# EAGLE design mic2 (EAGLE 6.1)

## Sheet 1 of 2
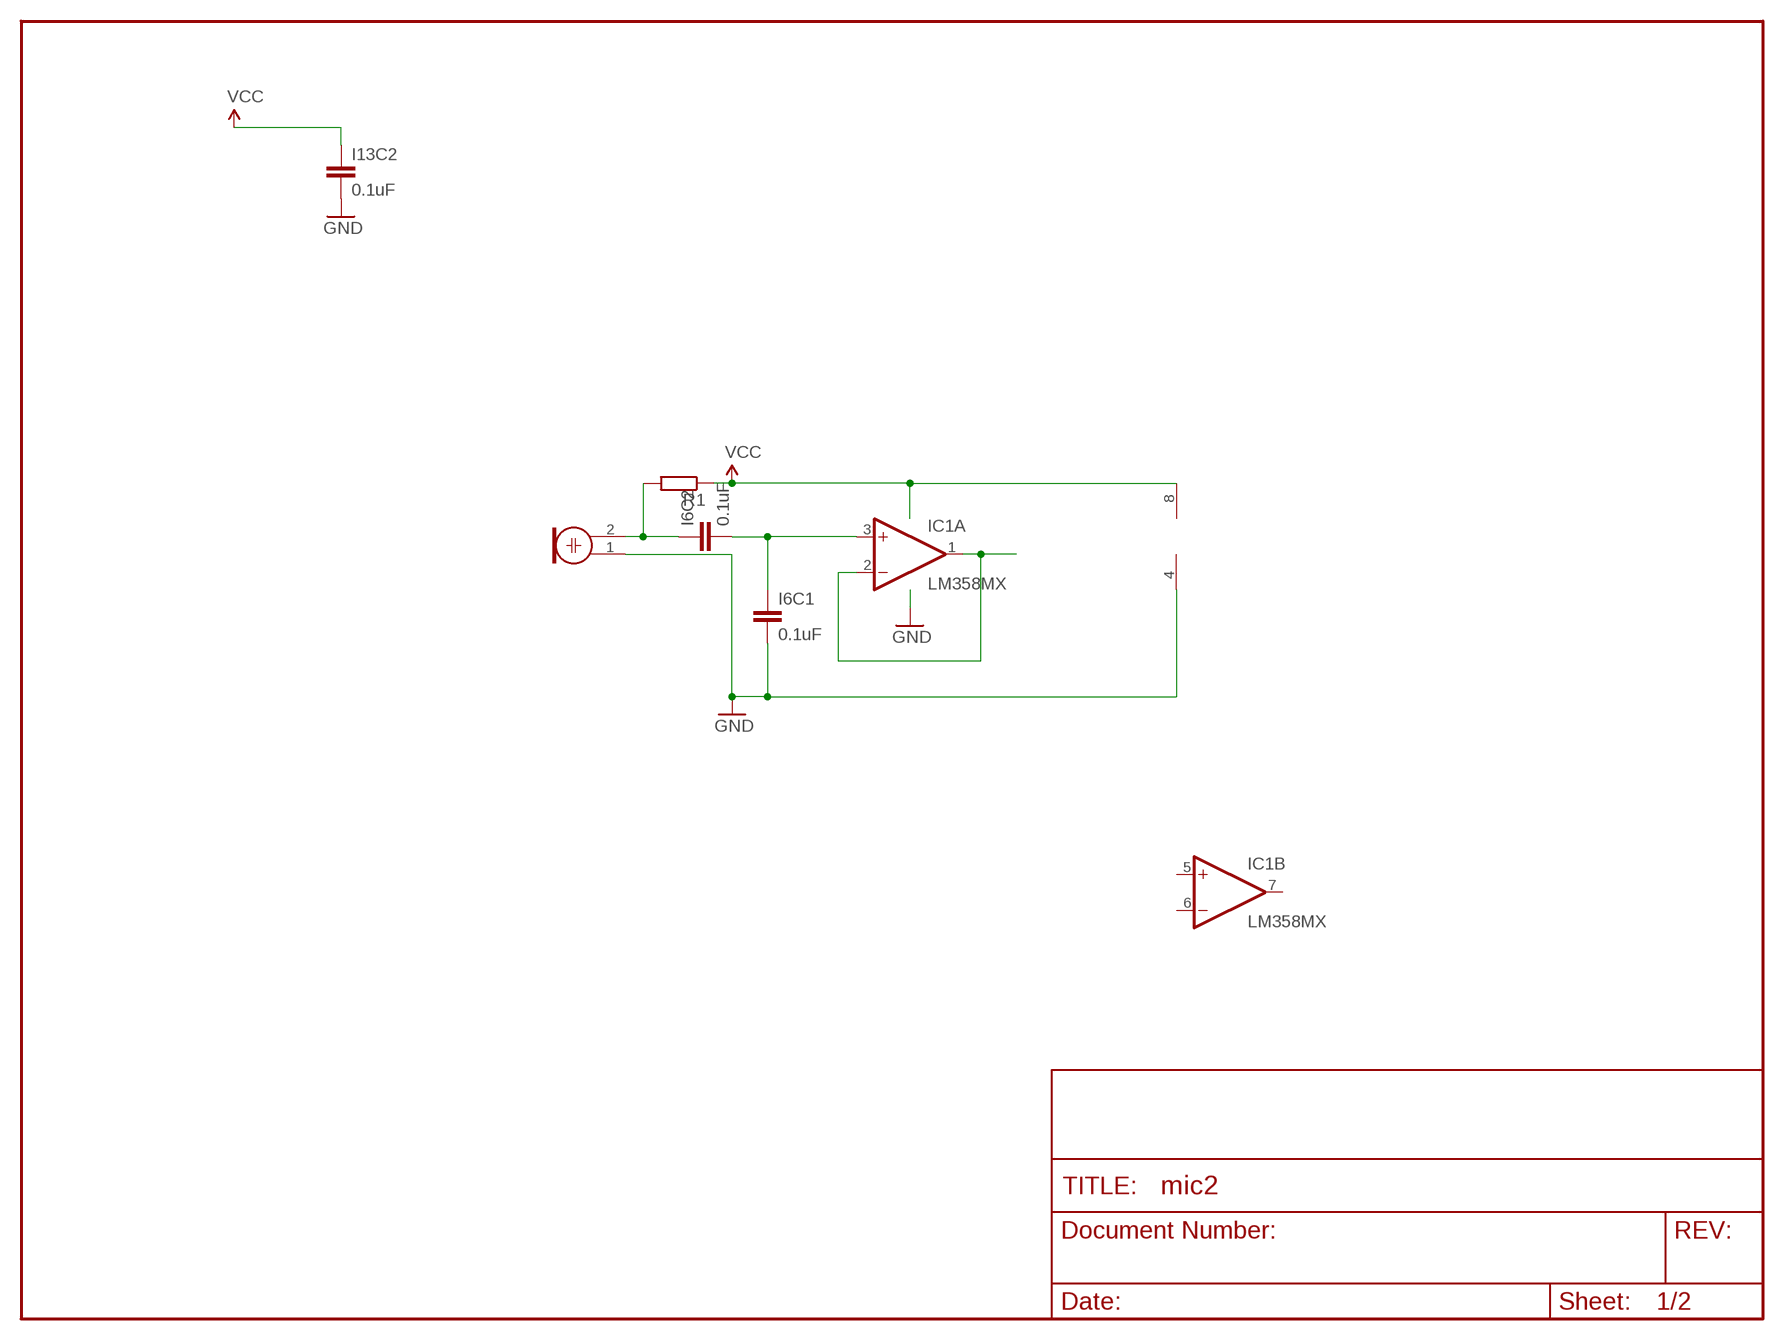
[diagram p0: schematic, sheet 1]

### Parts
I6C1  0.1uF  CAP1206  [1206]
I6C2  0.1uF  CAP1206  [1206]
I13C2  0.1uF  CAP1206  [1206]
IC1  LM358MX  [SO08]
M1  ELECTRET_MICROPHON-WM-61A  [WM-61A]
R1  R-EU_M0805  [M0805]

### Nets
BLA: I6C1.1 I6C2.2 IC1.3(A:+IN)
GND: I6C1.2 I13C2.2 IC1.4(P:V-) M1.1 ; also sheet 2
N$2: I6C2.1 M1.2 R1.2
SIG: IC1.1(A:OUT) IC1.2(A:-IN)
VCC: I13C2.1 IC1.8(P:V+) R1.1 ; also sheet 2
Unconnected: IC1.5(B:+IN) IC1.6(B:-IN) IC1.7(B:OUT)

## Sheet 2 of 2
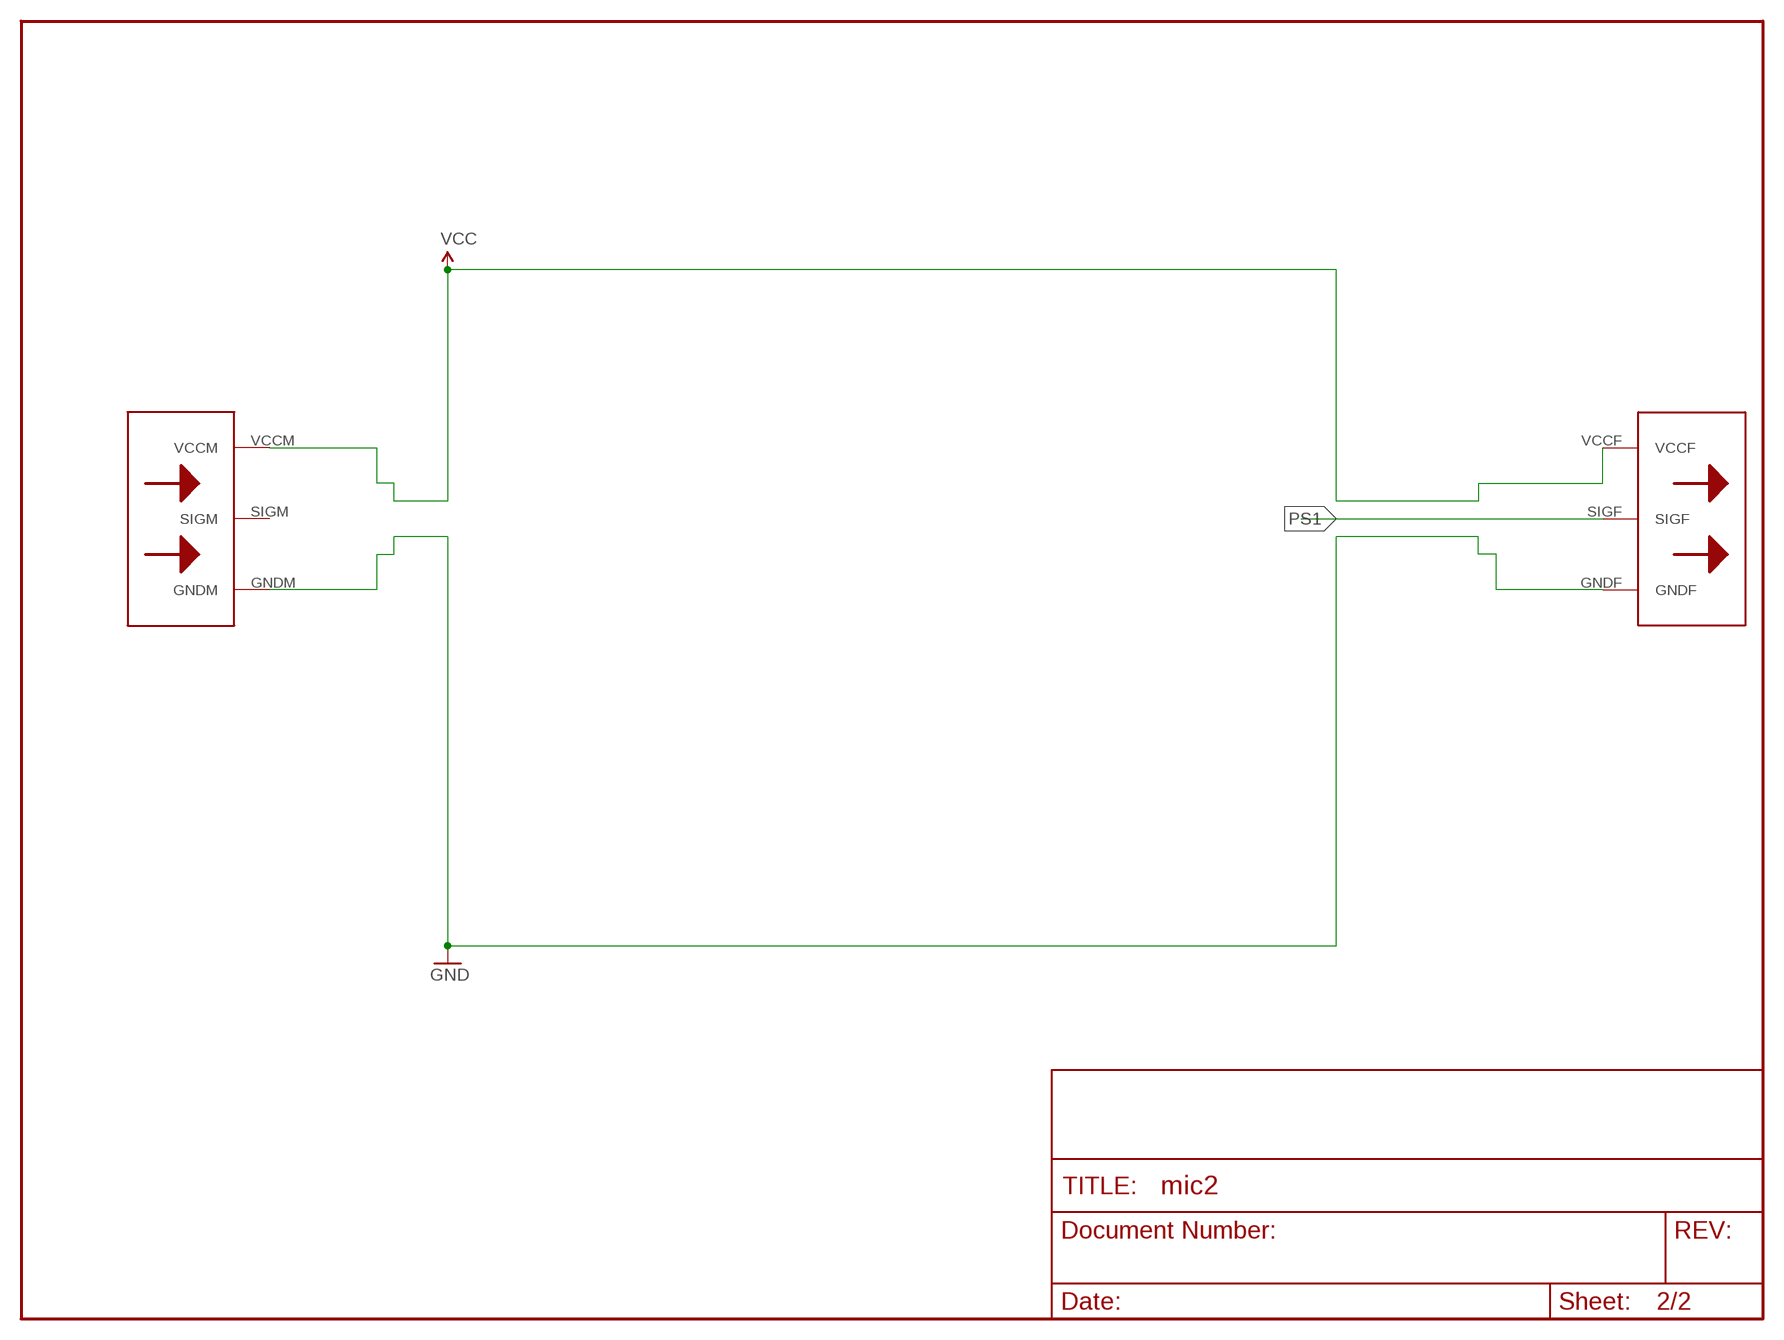
[diagram p1: schematic, sheet 2]

### Parts
U$3  BIGBIT  [BIGBIT]

### Nets
GND: U$3.GNDF U$3.GNDM ; also sheet 1
PS1: U$3.SIGF
VCC: U$3.VCCF U$3.VCCM ; also sheet 1
Unconnected: U$3.SIGM

## Library data of the parts
I6C1 I6C2 I13C2 = SparkFun:CAP: Capacitor Standard 0603 ceramic capacitor, and 0.1" leaded capacitor.
IC1 = linear:LM358: OP AMP also LM158; LM258; LM2904 Source: http://cache.national.com/ds/LM/LM158.pdf
M1 = microphon:ELECTRET_MICROPHON-: Electret Condenser Microphone
R1 = rcl:R-EU_: RESISTOR, European symbol
U$3 = bigbits:BIGBIT: BigBit completo Male entra o Sinal Female sai o Sinal Esquerda --> Direita

## Board
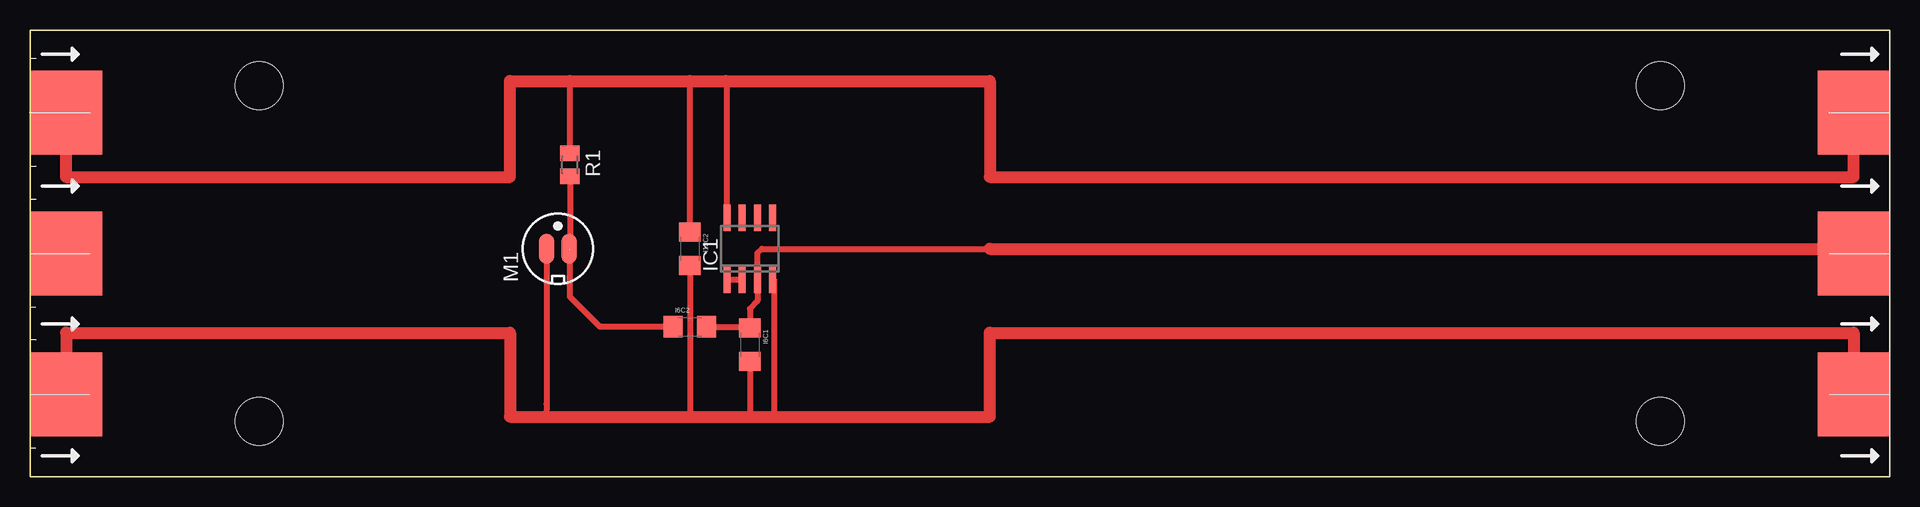
[diagram p2: board, top side]

Size 155 x 37.25 mm. Coordinates in mm from the lower left corner, seen from the top.
Outline: 0,0 155,0 155,37.25 0,37.25 0,0
Copper layers (1*16): Top 0.035mm / dielectric 1.5mm / Bottom 0.035mm
Design rules: minimum track width 10mil, minimum drill 24mil, track to track 8mil, track to pad 8mil, pad to pad 8mil, via to via 8mil, smd to smd 8mil, copper to edge 40mil, drill to drill 8mil, minimum pad ring 10mil, minimum via ring 8mil, stop-mask expansion 4mil, vias tented up to drill 0mil, thermal gap 10mil

### Footprints (pad centres in the part's own frame; a part is rotated, then mirrored left to right if it is on the bottom)
1206 = smd 1.6 x 1.8: 1 -1.4,0; 2 1.4,0
SO08 = smd 0.6 x 2.2: 1 -1.905,-2.6; 2 -0.635,-2.6; 3 0.635,-2.6; 4 1.905,-2.6; 5 1.905,2.6; 6 0.635,2.6; 7 -0.635,2.6; 8 -1.905,2.6
WM-61A = smd 2.5 x 1.3: 1 0,0.95; 2 0,-0.95
M0805 = smd 1.3 x 1.6: 1 -0.95,0; 2 0.95,0
BIGBIT = smd 6 x 7: GNDF 152,-30.38; GNDM 3,-30.38; SIGF 152,-18.64; SIGM 3,-18.64; VCCF 152,-6.89; VCCM 3,-6.89 | hole 4: 135.9,-4.64; 135.9,-32.639; 19.1,-4.64; 19.1,-32.639

### Placement (x,y rotation side)
I6C1  60,11 270 top
I6C2  55,12.5 0 top
I13C2  55,19 270 top
IC1  60,19 0 top
M1  44,19 90 top
R1  45,26 270 top
U$3  0,37.25 0 top

### Tracks (layer width: path | path; a pad name or v marks a point on that pad's centre or on a via)
BLA
  Top 0.5: 59.6,12.4 59.9,12.1 | I6C2.2 59.9,12.5 | 59.9,12.5 I6C1.1 60,14 60.63,14.63 IC1.3 60.63,18.64 61,19 80,19 | 59.9,12.5 59.9,12.1 | 59.9,12.1 60,12
  Top 1: 80,19 152,19 152,18
GND
  Top 0.5: IC1.4 62,16.4 62,5 | I6C1.2 60,5 | M1.1 43.05,6.05 43,5 | I13C2.2 55,5
  Top 1: U$3.GNDF 152,12 80,12 80,5 62,5 60,5 55,5 43,5 40,5 40,12 3,12 U$3.GNDM
N$2  (1 unrouted)
  Top 0.5: M1.2 45,18.95 45,15 47.5,12.5 I6C2.1 | R1.2 45,19
SIG
  Top 0.5: IC1.2 IC1.1
VCC
  Top 0.5: R1.1 45,33 | I13C2.1 55,33 | IC1.8 58.09,32.91 58,33
  Top 1: U$3.VCCF 152,25 80,25 80,33 58,33 55,33 45,33 40,33 40,25 3,25 U$3.VCCM